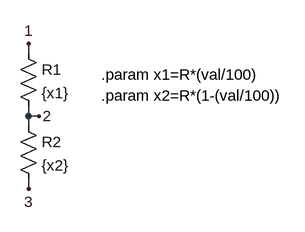
[diagram p0: schematic pot.asc]
pot.asc, the LTspice schematic file:
Version 4
SHEET 1 880 680
WIRE 48 64 48 48
WIRE 48 160 48 144
WIRE 64 160 48 160
WIRE 48 176 48 160
WIRE 48 272 48 256
FLAG 48 48 1
FLAG 64 160 2
FLAG 48 272 3
SYMBOL res 32 48 R0
SYMATTR InstName R1
SYMATTR Value {x1}
SYMBOL res 32 160 R0
SYMATTR InstName R2
SYMATTR Value {x2}
TEXT 160 96 Left 2 !.param x1=R*(val/100)
TEXT 160 128 Left 2 !.param x2=R*(1-(val/100))

The netlist it stands for:
* pot.asc
R1 1 2 {x1}
R2 2 3 {x2}
.param x1=R*(val/100)
.param x2=R*(1-(val/100))
.backanno
.end